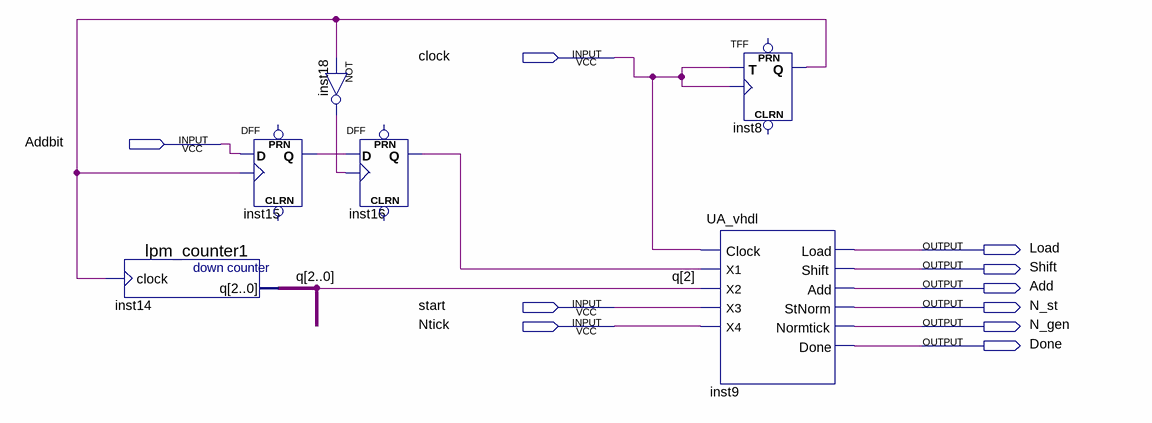
[diagram p0: schematic sheet]
// Quartus schematic newUA.bdf as structural Verilog: 6 symbols, 10 pins
module newUA (
  input  clock,
  input  Addbit,
  input  start,
  input  Ntick,
  output Load,
  output Shift,
  output Add,
  output N_st,
  output N_gen,
  output Done
);

  wire inst8_q, inst15_q, inst16_q, inst18_out;
  wire [2:0] q;

  lpm_counter1 inst14 (.clock(inst8_q), .q(q));
  DFF inst15 (.CLK(inst8_q), .D(Addbit), .Q(inst15_q));  // open: CLRN, PRN
  not inst18 (inst18_out, inst8_q);
  DFF inst16 (.CLK(inst18_out), .D(inst15_q), .Q(inst16_q));  // open: CLRN, PRN
  UA_vhdl inst9 (
    .Clock(clock), .X1(inst16_q), .X2(q[2]), .X3(start), .X4(Ntick), .Load(Load), .Shift(Shift), .Add(Add),
    .StNorm(N_st), .Normtick(N_gen), .Done(Done));
  TFF inst8 (.T(clock), .CLK(clock), .Q(inst8_q));  // open: PRN, CLRN
endmodule
